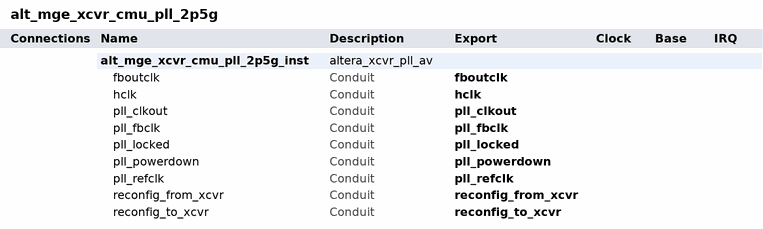
[diagram p0: system contents]
# Platform Designer (Qsys) system alt_mge_xcvr_cmu_pll_2p5g, Arria V Unknown
# Parameters at their usual value, and those the tool derives, are not listed.
package require -exact qsys 14.1
create_system alt_mge_xcvr_cmu_pll_2p5g
set_project_property DEVICE_FAMILY {Arria V}
set_project_property DEVICE Unknown

add_instance alt_mge_xcvr_cmu_pll_2p5g_inst altera_xcvr_pll_av 14.1
set_instance_property alt_mge_xcvr_cmu_pll_2p5g_inst AUTO_EXPORT true
set_instance_parameter_value alt_mge_xcvr_cmu_pll_2p5g_inst device_family {Arria V}
set_instance_parameter_value alt_mge_xcvr_cmu_pll_2p5g_inst feedback_clk internal
set_instance_parameter_value alt_mge_xcvr_cmu_pll_2p5g_inst gui_pll_reconfig_pll0_clk_network x1
set_instance_parameter_value alt_mge_xcvr_cmu_pll_2p5g_inst gui_pll_reconfig_pll0_data_rate {3125 Mbps}
set_instance_parameter_value alt_mge_xcvr_cmu_pll_2p5g_inst gui_pll_reconfig_pll0_pll_type CMU
set_instance_parameter_value alt_mge_xcvr_cmu_pll_2p5g_inst gui_pll_reconfig_pll0_refclk_freq {125.0 MHz}
set_instance_parameter_value alt_mge_xcvr_cmu_pll_2p5g_inst gui_pll_reconfig_pll0_refclk_sel 0
set_instance_parameter_value alt_mge_xcvr_cmu_pll_2p5g_inst pll_reconfig 0
set_instance_parameter_value alt_mge_xcvr_cmu_pll_2p5g_inst refclks 1

# exported interfaces
add_interface fboutclk conduit end
set_interface_property fboutclk EXPORT_OF alt_mge_xcvr_cmu_pll_2p5g_inst.fboutclk
add_interface hclk conduit end
set_interface_property hclk EXPORT_OF alt_mge_xcvr_cmu_pll_2p5g_inst.hclk
add_interface pll_clkout conduit end
set_interface_property pll_clkout EXPORT_OF alt_mge_xcvr_cmu_pll_2p5g_inst.pll_clkout
add_interface pll_fbclk conduit end
set_interface_property pll_fbclk EXPORT_OF alt_mge_xcvr_cmu_pll_2p5g_inst.pll_fbclk
add_interface pll_locked conduit end
set_interface_property pll_locked EXPORT_OF alt_mge_xcvr_cmu_pll_2p5g_inst.pll_locked
add_interface pll_powerdown conduit end
set_interface_property pll_powerdown EXPORT_OF alt_mge_xcvr_cmu_pll_2p5g_inst.pll_powerdown
add_interface pll_refclk conduit end
set_interface_property pll_refclk EXPORT_OF alt_mge_xcvr_cmu_pll_2p5g_inst.pll_refclk
add_interface reconfig_from_xcvr conduit end
set_interface_property reconfig_from_xcvr EXPORT_OF alt_mge_xcvr_cmu_pll_2p5g_inst.reconfig_from_xcvr
add_interface reconfig_to_xcvr conduit end
set_interface_property reconfig_to_xcvr EXPORT_OF alt_mge_xcvr_cmu_pll_2p5g_inst.reconfig_to_xcvr

set_interconnect_requirement {$system} qsys_mm.clockCrossingAdapter HANDSHAKE
set_interconnect_requirement {$system} qsys_mm.insertDefaultSlave FALSE
set_interconnect_requirement {$system} qsys_mm.maxAdditionalLatency 1

save_system alt_mge_xcvr_cmu_pll_2p5g.qsys
